# Altium schematic sheet InputOutput.SchDoc
size A4
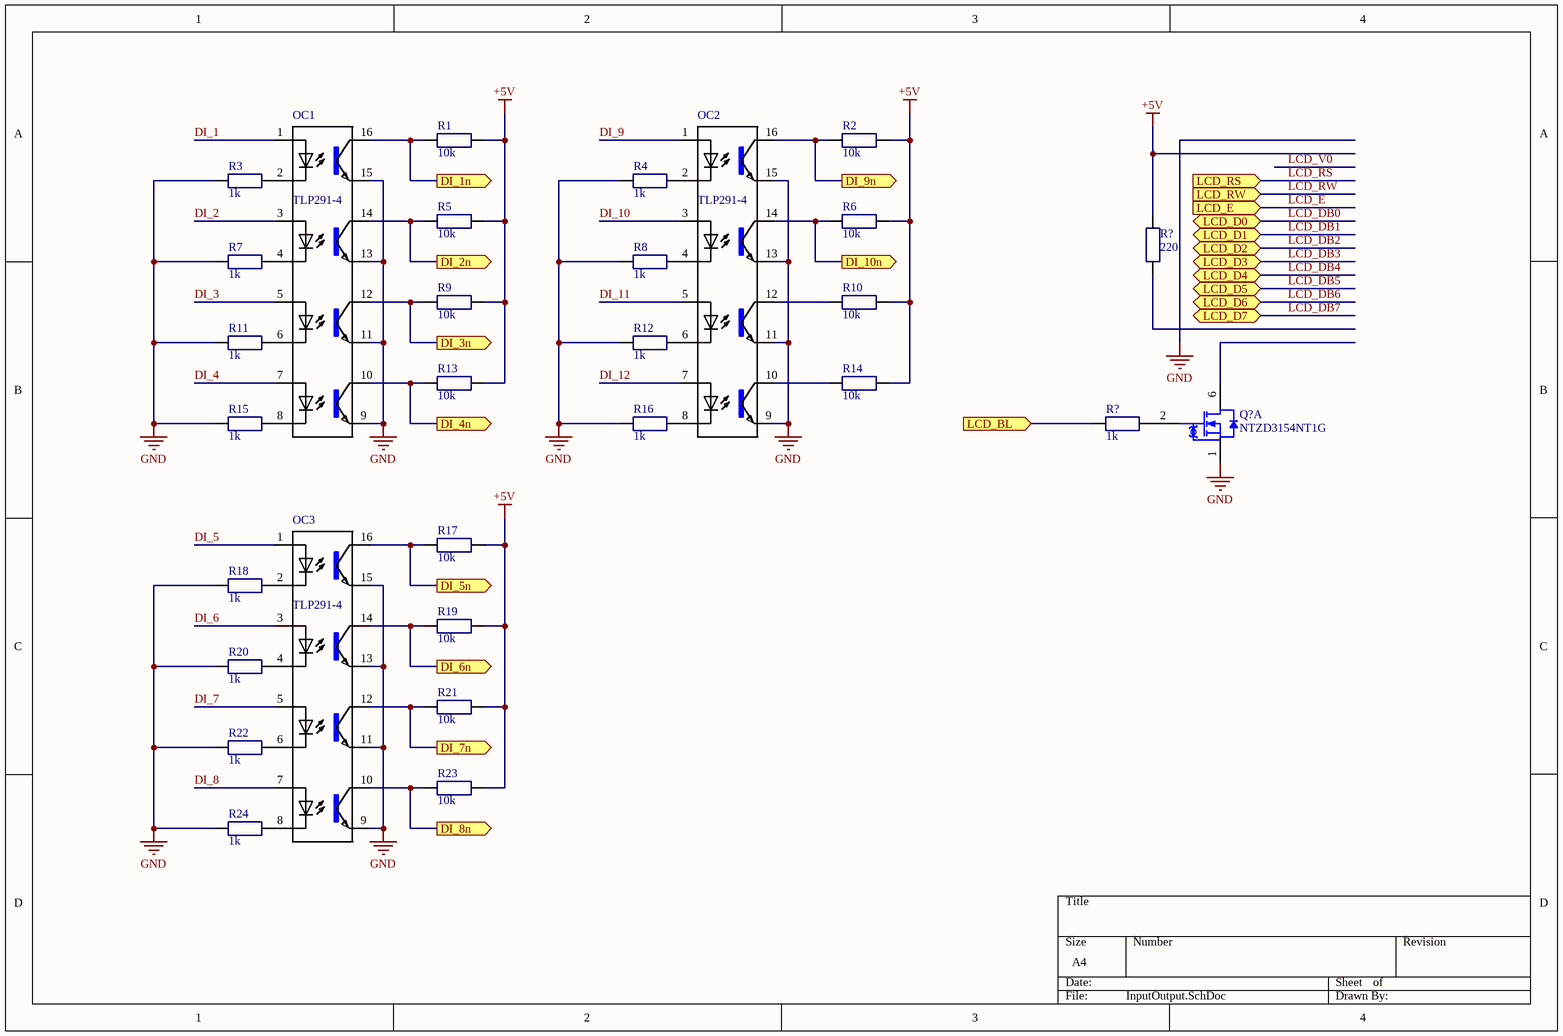
[diagram p0: InputOutput.SchDoc]

## Parts
(Parts that share a designator on the sheet are numbered #1, #2 ... from top to bottom, then left to right.)
OC1  TLP291-4
OC2  TLP291-4
OC3  TLP291-4
Q?  NTZD3154NT1G  [SOT-563-6-NTZD3154NT1G]  (part A of 2)
R1  value 10k  [RES_0402]  (hidden comment: RES_0402)
R2  value 10k  [RES_0402]  (hidden comment: RES_0402)
R3  value 1k  [RES_0402]  (hidden comment: RES_0402)
R4  value 1k  [RES_0402]  (hidden comment: RES_0402)
R5  value 10k  [RES_0402]  (hidden comment: RES_0402)
R6  value 10k  [RES_0402]  (hidden comment: RES_0402)
R7  value 1k  [RES_0402]  (hidden comment: RES_0402)
R8  value 1k  [RES_0402]  (hidden comment: RES_0402)
R9  value 10k  [RES_0402]  (hidden comment: RES_0402)
R10  value 10k  [RES_0402]  (hidden comment: RES_0402)
R11  value 1k  [RES_0402]  (hidden comment: RES_0402)
R12  value 1k  [RES_0402]  (hidden comment: RES_0402)
R13  value 10k  [RES_0402]  (hidden comment: RES_0402)
R14  value 10k  [RES_0402]  (hidden comment: RES_0402)
R15  value 1k  [RES_0402]  (hidden comment: RES_0402)
R16  value 1k  [RES_0402]  (hidden comment: RES_0402)
R17  value 10k  [RES_0402]  (hidden comment: RES_0402)
R18  value 1k  [RES_0402]  (hidden comment: RES_0402)
R19  value 10k  [RES_0402]  (hidden comment: RES_0402)
R20  value 1k  [RES_0402]  (hidden comment: RES_0402)
R21  value 10k  [RES_0402]  (hidden comment: RES_0402)
R22  value 1k  [RES_0402]  (hidden comment: RES_0402)
R23  value 10k  [RES_0402]  (hidden comment: RES_0402)
R24  value 1k  [RES_0402]  (hidden comment: RES_0402)
R?#1  value 220  [RES_0402]  (hidden comment: RES_0402)
R?#2  value 1k  [RES_0402]  (hidden comment: RES_0402)

## Ports
DI_1n (out), DI_2n (out), DI_3n (out), DI_4n (out), DI_5n (out), DI_6n (out), DI_7n (out), DI_8n (out), DI_9n (out), DI_10n (out), LCD_BL (in), LCD_D0 (bidir), LCD_D1 (bidir), LCD_D2 (bidir), LCD_D3 (bidir), LCD_D4 (bidir), LCD_D5 (bidir), LCD_D6 (bidir), LCD_D7 (bidir), LCD_E (in), LCD_RS (in), LCD_RW (in)

## Nets
+5V: R1.2 R2.2 R5.2 R6.2 R9.2 R10.2 R13.2 R14.2 R17.2 R19.2 R21.2 R23.2 R?#1.2
GND: OC1.9(EMI) OC1.11(EMI) OC1.13(EMI) OC1.15(EMI) OC2.9(EMI) OC2.11(EMI) OC2.13(EMI) OC2.15(EMI) OC3.9(EMI) OC3.11(EMI) OC3.13(EMI) OC3.15(EMI) Q?.1(S1) R3.1 R4.1 R7.1 R8.1 R11.1 R12.1 R15.1 R16.1 R18.1 R20.1 R22.1 R24.1
DI_1: OC1.1(A)
DI_1n: OC1.16(COL) R1.1 ; port DI_1n
DI_2: OC1.3(A)
DI_2n: OC1.14(COL) R5.1 ; port DI_2n
DI_3: OC1.5(A)
DI_3n: OC1.12(COL) R9.1 ; port DI_3n
DI_4: OC1.7(A)
DI_4n: OC1.10(COL) R13.1 ; port DI_4n
DI_5: OC3.1(A)
DI_5n: OC3.16(COL) R17.1 ; port DI_5n
DI_6: OC3.3(A)
DI_6n: OC3.14(COL) R19.1 ; port DI_6n
DI_7: OC3.5(A)
DI_7n: OC3.12(COL) R21.1 ; port DI_7n
DI_8: OC3.7(A)
DI_8n: OC3.10(COL) R23.1 ; port DI_8n
DI_9: OC2.1(A)
DI_9n: OC2.16(COL) R2.1 ; port DI_9n
DI_10: OC2.3(A)
DI_10n: OC2.14(COL) R6.1 ; port DI_10n
DI_11: OC2.5(A)
DI_12: OC2.7(A)
LCD_BL: R?#2.2 ; port LCD_BL
LCD_DB0: port LCD_D0
LCD_DB1: port LCD_D1
LCD_DB2: port LCD_D2
LCD_DB3: port LCD_D3
LCD_DB4: port LCD_D4
LCD_DB5: port LCD_D5
LCD_DB6: port LCD_D6
LCD_DB7: port LCD_D7
LCD_E: port LCD_E
LCD_RS: port LCD_RS
LCD_RW: port LCD_RW
NetOC1_2: OC1.2(C) R3.2
NetOC1_4: OC1.4(C) R7.2
NetOC1_6: OC1.6(C) R11.2
NetOC1_8: OC1.8(C) R15.2
NetOC2_2: OC2.2(C) R4.2
NetOC2_4: OC2.4(C) R8.2
NetOC2_6: OC2.6(C) R12.2
NetOC2_8: OC2.8(C) R16.2
NetOC2_10: OC2.10(COL) R14.1
NetOC2_12: OC2.12(COL) R10.1
NetOC3_2: OC3.2(C) R18.2
NetOC3_4: OC3.4(C) R20.2
NetOC3_6: OC3.6(C) R22.2
NetOC3_8: OC3.8(C) R24.2
NetQ?_2: Q?.2(G1) R?#2.1

Not connected (* = marked no-connect by the designer): Q? 6(D1); R?#1 1

## Library data of the parts
OC1-OC3 = TLP291-4: Optocoupler, Phototrans, 2.5kv, S0-16 package; MF: Toshiba; MP: TLP293; Package: SOIC-4 Toshiba; Price: None; SnapEDA_Link: https://www.snapeda.com/parts/TLP293/Toshiba/view-part/?ref=snap; Availability: Unavailable; Value: *
Q? = NTZD3154NT1G: Small Signal MOSFET, 20 V, 540 mA, Dual N-Channel, 6-Pin SOT-563, Pb-Free; Manufacturer: On Semiconductor; Channel Polarity: N Channel; Ciss Typ (pF): 80; Coss Typ (pF): 13; Crss Typ (pF): 10; ID Max (A): 0.54; Packing: Tape and Reel; V(BR)DSS Min (V): 20; VGS Max (V): 6; VGS(th) Max (V): 1; DatasheetVersion: Rev. 2; PackageVersion: Rev. F, 04/2005; PackageReference: SOT-563-6-463A-01; PackageDescription: 6-Pin Small Outline Transistor, Body 1.6 x 1.2 mm, Pitch 0.5 mm; Configuration: Dual; Package Type: SOT-563; RoHS: Pb-Free; Mounting Technology: Surface Mount; PartNumber: NTZD3154NT1G; ComponentLink2Description: Datasheet; ComponentLink2URL: http://www.onsemi.com/pub_link/Collateral/NTZD3154N-D.PDF; Supplier 1: *; Supplier Part Number 1: *
R1-R24 R?#1 R?#2 = RES_0402: SMD Chip Resistor 0402; SIGN: HL; PartDescription: Chip resistor; Package: 0402; Component Class: A; Operating Temperature: *; Tolerance: *